# EAGLE design schematic_V3 (EAGLE 7.5.0)
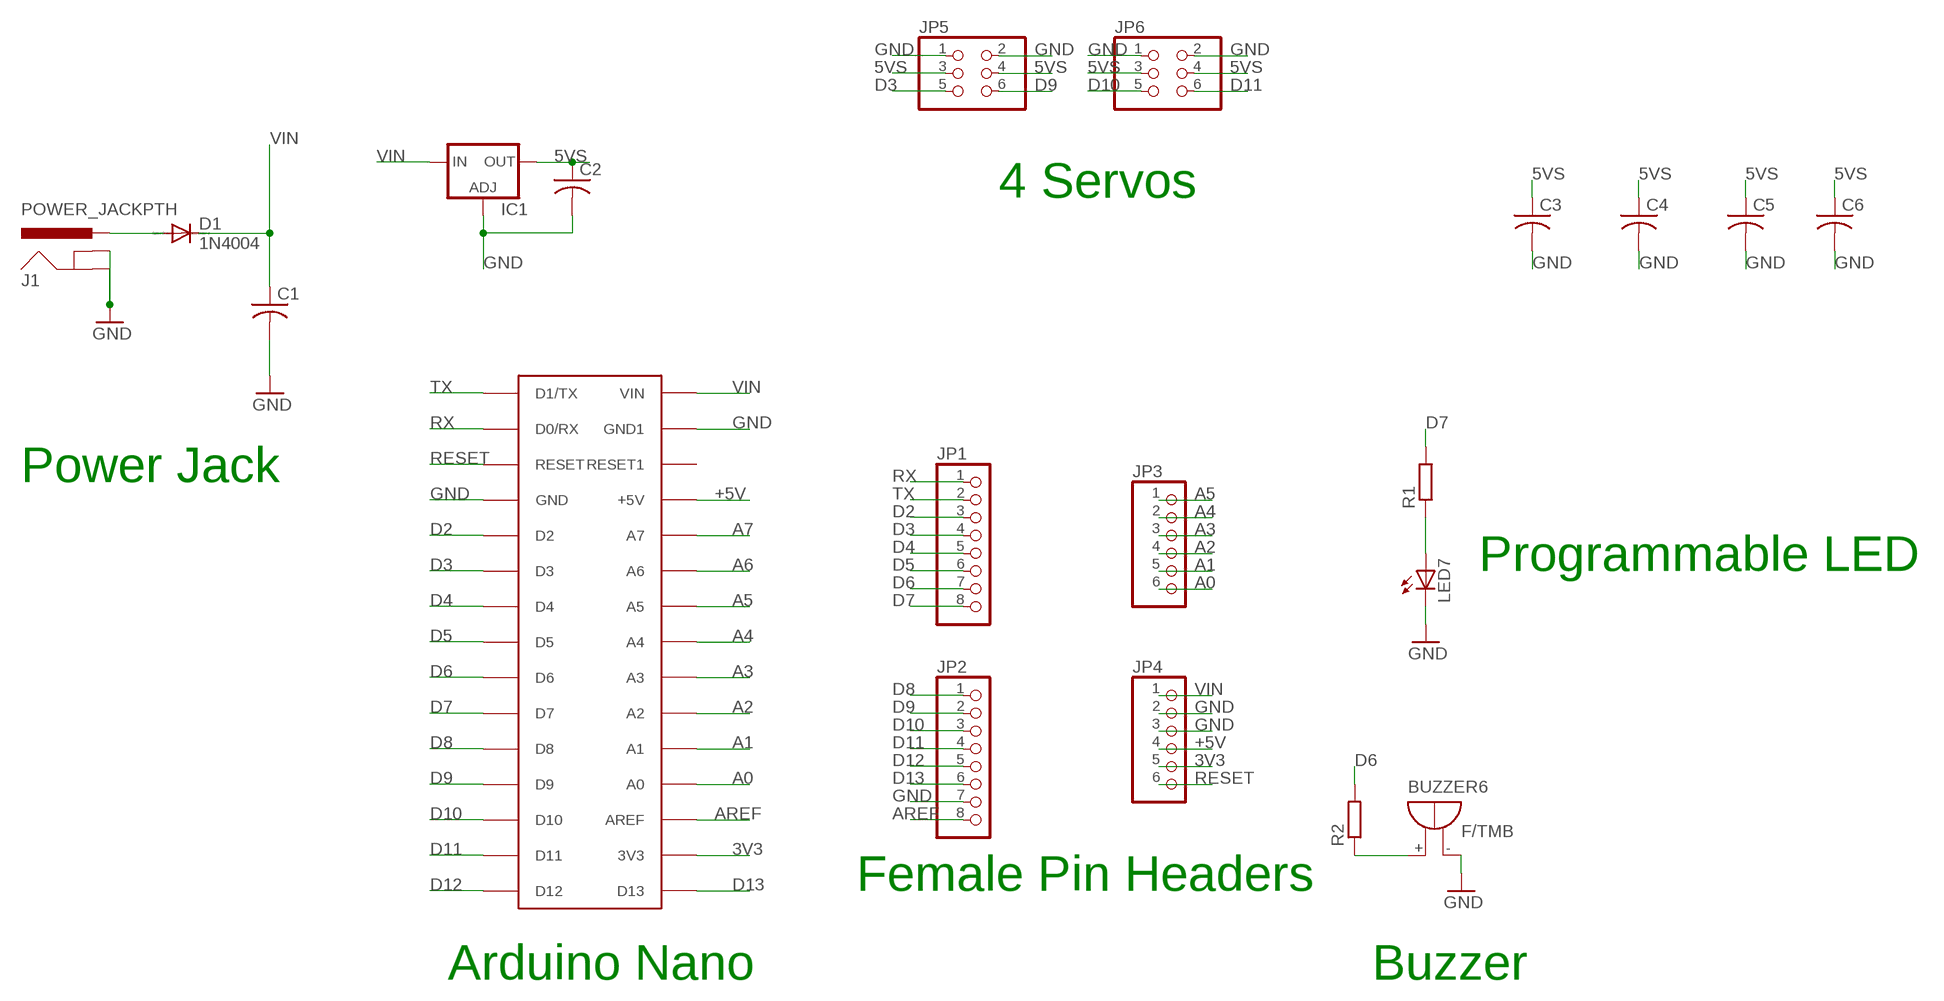
[diagram p0: schematic, sheet 1]

## Parts
BUZZER6  F/TMB  [F/TMB]
C1  C-USC1206  [C1206]
C2  C-USC1206  [C1206]
C3  C-USC1206  [C1206]
C4  C-USC1206  [C1206]
C5  C-USC1206  [C1206]
C6  C-USC1206  [C1206]
D1  1N4004  [DO41-10]
IC1  VR1  LD117AS33TR  [SOT223]
J1  POWER_JACKPTH  [POWER_JACK_PTH]
JP1  PINHD-1X8  [1X08]
JP2  PINHD-1X8  [1X08]
JP3  PINHD-1X6  [1X06]
JP4  PINHD-1X6  [1X06]
JP5  PINHD-2X3  [2X03]
JP6  PINHD-2X3  [2X03]
LED7  LED5MM  [LED5MM]
R1  R-EU_0207/10  [0207/10]
R2  R-EU_0207/10  [0207/10]
U$1  ARDUINONANO  [PDIP-32]

## Nets
3V3: JP4.5 U$1.3V3
5VS: C2.1 C3.1 C4.1 C5.1 C6.1 IC1.4(OUT) JP5.3 JP5.4 JP6.3 JP6.4
+5V: JP4.4 U$1.+5V
A0: JP3.6 U$1.A7(A0)
A1: JP3.5 U$1.A6(A1)
A2: JP3.4 U$1.A5(A2)
A3: JP3.3 U$1.A4(A3)
A4: JP3.2 U$1.A3(A4)
A5: JP3.1 U$1.A2(A5)
A6: U$1.A1(A6)
A7: U$1.A0(A7)
AREF: JP2.8 U$1.AREF
D2: JP1.3 U$1.D2
D3: JP1.4 JP5.5 U$1.D3
D4: JP1.5 U$1.D4
D5: JP1.6 U$1.D5
D6: JP1.7 R2.2 U$1.D6
D7: JP1.8 R1.2 U$1.D7
D8: JP2.1 U$1.D8
D9: JP2.2 JP5.6 U$1.D9
D10: JP2.3 JP6.5 U$1.D10
D11: JP2.4 JP6.6 U$1.D11
D12: JP2.5 U$1.D12
D13: JP2.6 U$1.D13
GND: BUZZER6.- C1.2 C2.2 C3.2 C4.2 C5.2 C6.2 IC1.1(ADJ) J1.GND J1.GNDBREAK JP2.7 JP4.2 JP4.3 JP5.1 JP5.2 JP6.1 JP6.2 LED7.K(C) U$1.GND U$1.GND1
N$1: LED7.A R1.1
N$2: D1.A J1.PWR
N$4: BUZZER6.+ R2.1
RESET: JP4.6 U$1.RESET
RX: JP1.1 U$1.D0/RX
TX: JP1.2 U$1.D1/TX
VIN: C1.1 D1.C IC1.3(IN) JP4.1 U$1.VIN
Unconnected: U$1.RESET1

## Notes on the sheet
- 4 Servos
- Power Jack
- Programmable LED
- Female Pin Headers
- Arduino Nano | Buzzer

## Library data of the parts
BUZZER6 = buzzer:F/TMB: BUZZER Source: Buerklin; OC_FARNELL: unknown; OC_NEWARK: unknown
C1-C6 = adafruit:C-US: CAPACITOR, American symbol
D1 = diode:1N4004: DIODE general purpose rectifier, 1 A
IC1 = v-reg:LD117A?*: Low drop fixed and adjustable positive voltage regulators 1 A Source: http://www.st.com/stonline/products/literature/ds/7194/ld1117axx.pdf
J1 = SparkFun:POWER_JACK: Power Jack This is the standard 5.5mm barrel jack for power. The PTH is the most common, proven, reliable, footprint. All others are experimental. The Slot footprint only works if the mill layer is transmitted to the PCB fab house so be warned. Spark Fun Electronics SKU : PRT-00119. Mating wall wart : TOL-00298 (and others)
JP1 JP2 = pinhead:PINHD-1X8: PIN HEADER
JP3 JP4 = pinhead:PINHD-1X6: PIN HEADER
JP5 JP6 = pinhead:PINHD-2X3: PIN HEADER
LED7 = led:LED: LED OSRAM: - CHIPLED LG R971, LG N971, LY N971, LG Q971, LY Q971, LO R971, LY R971 LH N974, LH R974 LS Q976, LO Q976, LY Q976 LO Q996 - Hyper CHIPLED LW Q18S LB Q993, LB Q99A, LB R99A - SideLED LS A670, LO A670, LY A670, LG A670, LP A670 LB A673, LV A673, LT A673, LW A673 LH A674 LY A675 LS A676, LA A676, LO A676, LY A676, LW A676 LS A679, LY A679, LG A679 - Hyper Micro SIDELED® LS Y876, LA Y876, LO Y876, LY Y876 LT Y87S - SmartLED LW L88C, LW L88S LB L89C, LB L89S, LG L890 LS L89K, LO L89K, LY L89K LS L896, LA L896, LO L896, LY L896 - TOPLED LS T670, LO T670, LY T670, LG T670, LP T670 LSG T670, LSP T670, LSY T670, LOP T670, LYG T670 LG T671, LOG T671, LSG T671 LB T673, LV T673, LT T673, LW T673 LH T674 LS T676, LA T676, LO T676, LY T676, LB T676, LH T676, LSB T676, LW T676 LB T67C, LV T67C, LT T67C, LS T67K, LO T67K, LY T67K, LW E67C LS E67B, LA E67B, LO E67B, LY E67B, LB E67C, LV E67C, LT E67C LW T67C LS T679, LY T679, LG T679 LS T770, LO T770, LY T770, LG T770, LP T770 LB T773, LV T773, LT T773, LW T773 LH T774 LS E675, LA E675, LY E675, LS T675 LS T776, LA T776, LO T776, LY T776, LB T776 LHGB T686 LT T68C, LB T68C - Hyper Mini TOPLED® LB M676 - Mini TOPLED Santana® LG M470 LS M47K, LO M47K, LY M47K Source: http://www.osram.convergy.de LUXEON: - LUMILED® LXK2-PW12-R00, LXK2-PW12-S00, LXK2-PW14-U00, LXK2-PW14-V00 LXK2-PM12-R00, LXK2-PM12-S00, LXK2-PM14-U00 LXK2-PE12-Q00, LXK2-PE12-R00, LXK2-PE12-S00, LXK2-PE14-T00, LXK2-PE14-U00 LXK2-PB12-K00, LXK2-PB12-L00, LXK2-PB12-M00, LXK2-PB14-N00, LXK2-PB14-P00, LXK2-PB14-Q00 LXK2-PR12-L00, LXK2-PR12-M00, LXK2-PR14-Q00, LXK2-PR14-R00 LXK2-PD12-Q00, LXK2-PD12-R00, LXK2-PD12-S00 LXK2-PH12-R00, LXK2-PH12-S00 LXK2-PL12-P00, LXK2-PL12-Q00, LXK2-PL12-R00 Source: www.luxeon.com KINGBRIGHT: KA-3528ASYC Source: www.kingbright.com
R1 R2 = rcl:R-EU_: RESISTOR, European symbol
U$1 = rocketfarm:ARDUINONANO

## Board
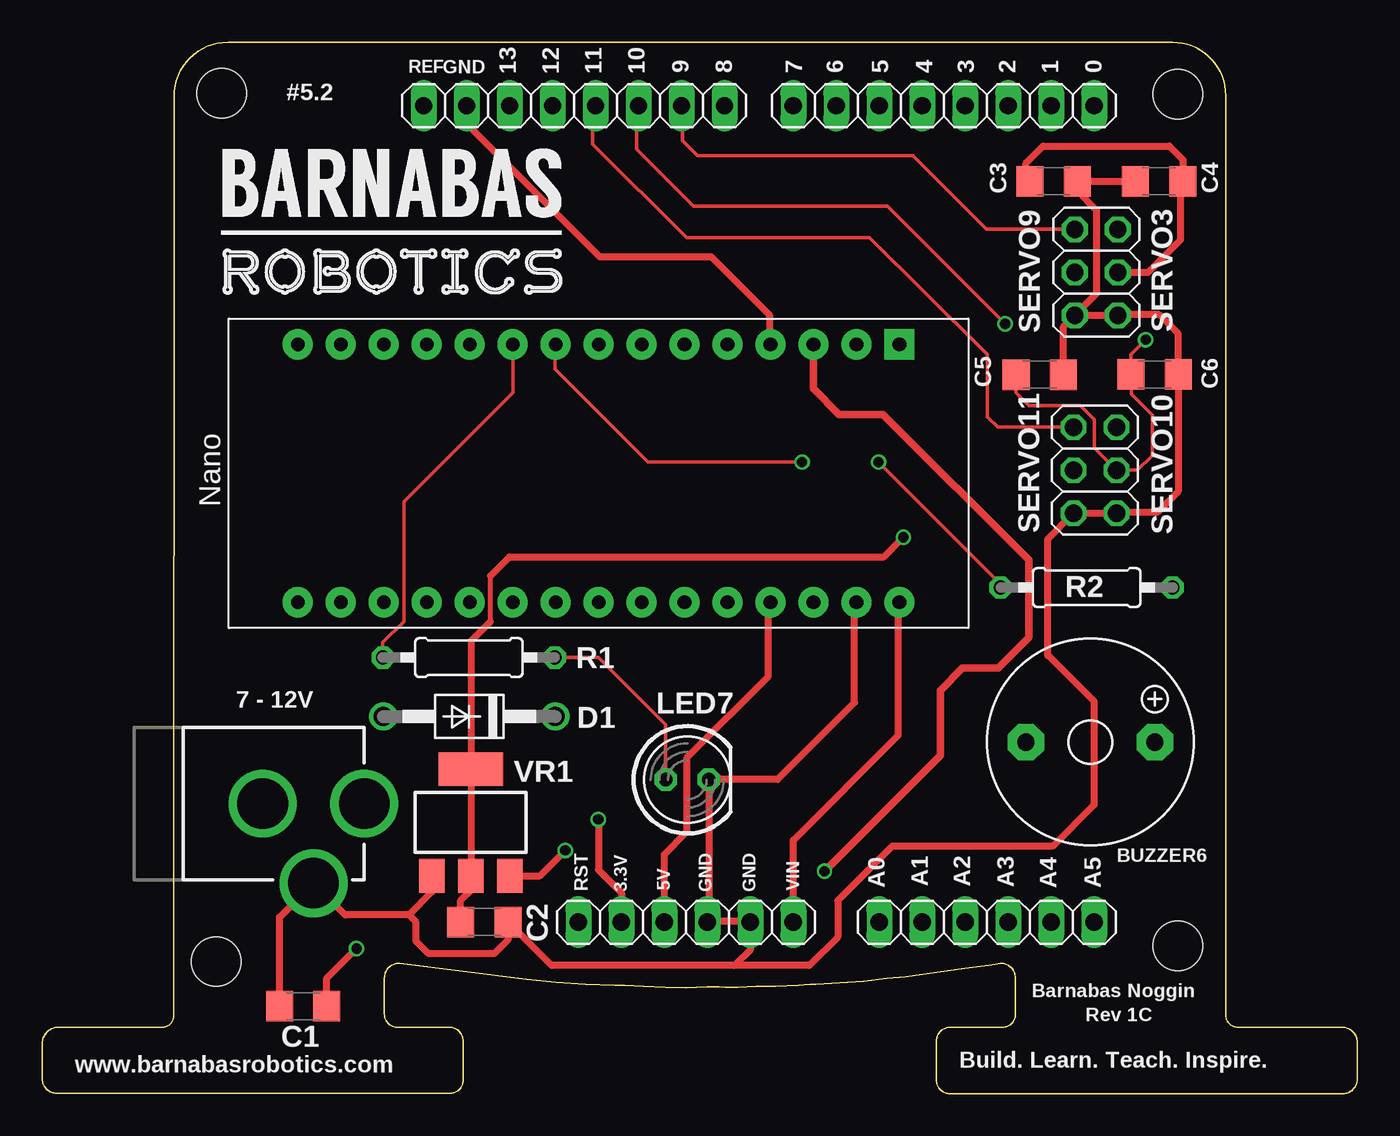
[diagram p1: board, top side]
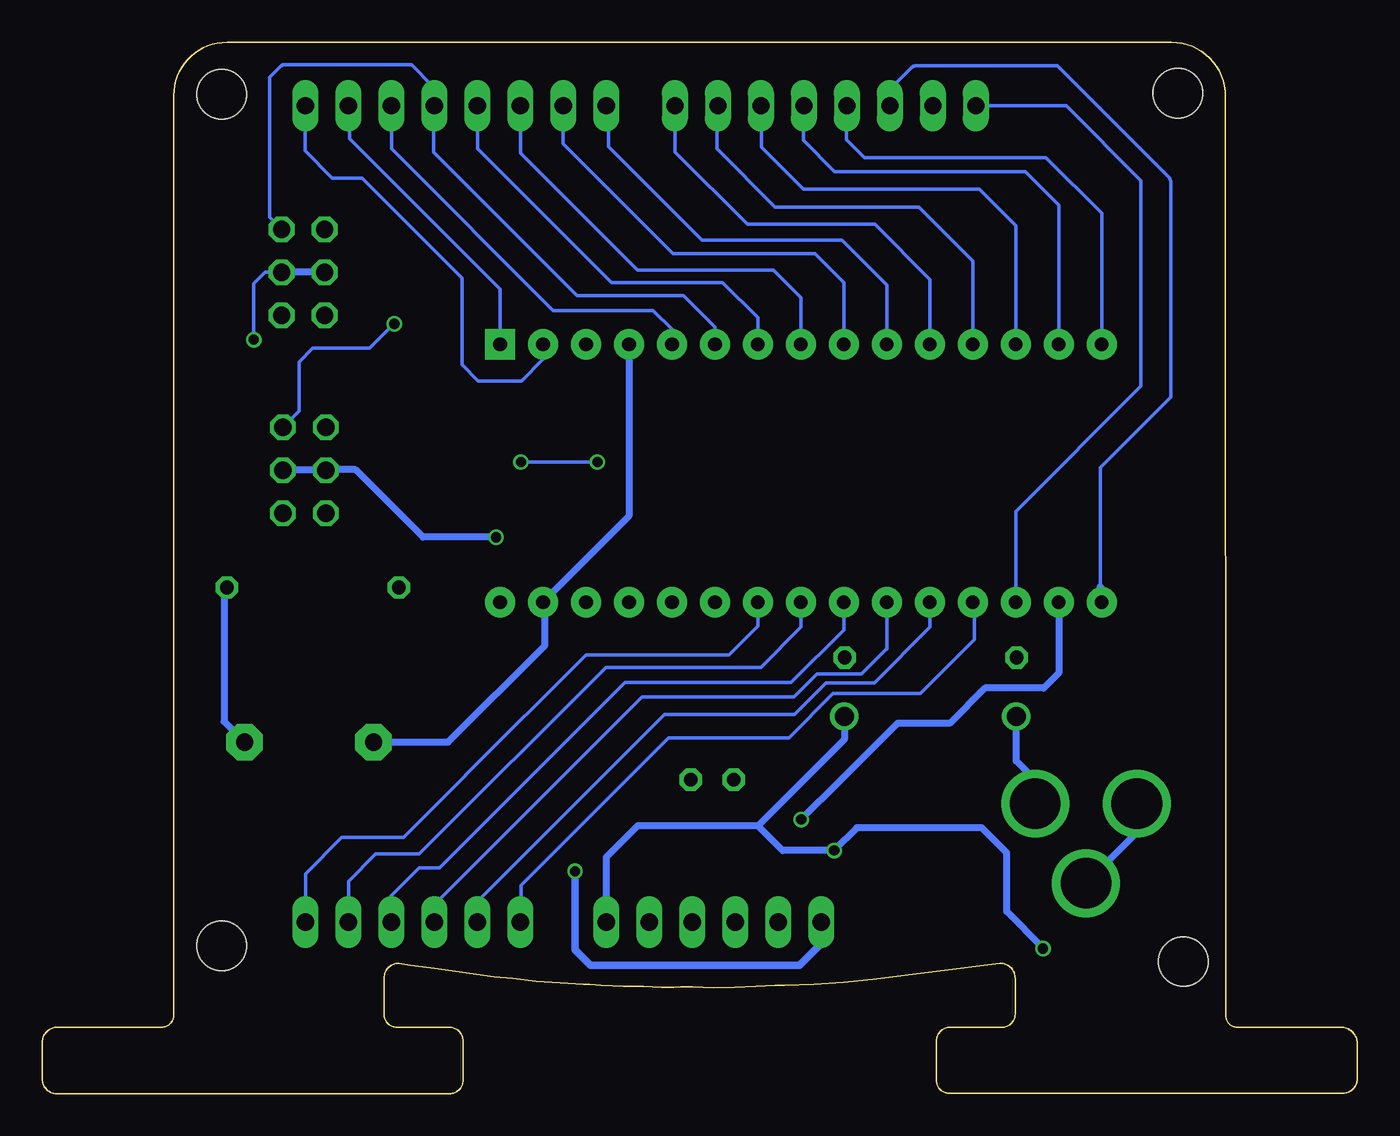
[diagram p2: board, bottom side, seen from below]

Size 77.7 x 62.13 mm. Coordinates in mm from the lower left corner, seen from the top.
Outline: 21.1,7.71 arc90 20.21,6.82 20.21,4.7 arc90 20.99,3.92 24.07,3.92 arc-90 24.86,3.13 24.86,0.76 arc-90 24.13,0.03 0.83,0.03 arc-90 0,0.86 0,2.97 arc-90 0.96,3.93 7.11,3.93 arc90 7.76,4.58 7.78,58.94 arc-90 10.97,62.13 66.79,62.13 arc-90 69.93,58.99 69.93,4.64 arc90 70.64,3.93 76.8,3.93 arc-90 77.7,3.03 77.7,0.84 arc-90 76.86,0 53.62,0 arc-90 52.84,0.78 52.84,3.08
Outline: 56.63,7.71 arc-90 57.5,6.84 57.5,4.66 arc-90 56.77,3.93 53.66,3.93 arc90 52.84,3.11 52.84,3.1
Outline: 21.11,7.71 28.63,6.75 arc7 33.83,6.41 arc-4 35.54,6.34 arc8 39.28,6.3 arc-7 40.36,6.29 arc9 41.1,6.29 arc-5 42.71,6.34 arc5 44.67,6.41 arc-3 45.71,6.47 arc6 49.92,6.81 arc-4 51,6.91
Outline: 51.01,6.91 54.53,7.39 arc2 56.64,7.71
Copper layers (1*16): Top 0.035mm / dielectric 1.5mm / Bottom 0.035mm
Design rules "EagleRules": minimum track width 7mil, minimum drill 12mil, track to track 7mil, track to pad 7mil, pad to pad 7mil, via to via 7mil, smd to smd 0mil, copper to edge 20mil, drill to drill 10mil, minimum pad ring 10mil, minimum via ring 6mil, stop-mask expansion 2mil, vias tented up to drill 25mil, thermal gap 10mil
Holes 2.9 mm at 10.6,59.12 67.1,59.06 67.1,8.73 10.28,7.81

### Footprints (pad centres in the part's own frame; a part is rotated, then mirrored left to right if it is on the bottom)
F/TMB = drill 1.016 pad 2.159 octagon: + 3.81,0; - -3.81,0
C1206 = smd 1.6 x 1.8: 1 -1.4,0; 2 1.4,0
DO41-10 = drill 1.118: A 5.08,0; C -5.08,0
SOT223 = smd 1.5 x 2: 1 -2.3,-3.15; 2 0,-3.15; 3 2.3,-3.15 | smd 3.8 x 2: 4 0,3.15
POWER_JACK_PTH = drill 2.997: GND 0,7.7; GNDBREAK 4.7,10.7; PWR 0,13.7
1X08 = drill 1.016 long: 1 -8.89,0; 2 -6.35,0; 3 -3.81,0; 4 -1.27,0; 5 1.27,0; 6 3.81,0; 7 6.35,0; 8 8.89,0
1X06 = drill 1.016 long: 1 -6.35,0; 2 -3.81,0; 3 -1.27,0; 4 1.27,0; 5 3.81,0; 6 6.35,0
2X03 = drill 1.016 octagon: 1 -2.54,-1.27; 2 -2.54,1.27; 3 0,-1.27; 4 0,1.27; 5 2.54,-1.27; 6 2.54,1.27
LED5MM = drill 0.813 octagon: A -1.27,0; K 1.27,0
0207/10 = drill 0.813 octagon: 1 -5.08,0; 2 5.08,0
PDIP-32 = drill 0.8 pad 1.778: 3V3 15.24,-35.56; +5V 15.24,-10.16; A0 15.24,-12.7; A1 15.24,-15.24; A2 15.24,-17.78; A3 15.24,-20.32; A4 15.24,-22.86; A5 15.24,-25.4; A6 15.24,-27.94; A7 15.24,-30.48; AREF 15.24,-33.02; D0/RX 0,-5.08; D2 0,-12.7; D3 0,-15.24; D4 0,-17.78; D5 0,-20.32; D6 0,-22.86; D7 0,-25.4; D8 0,-27.94; D9 0,-30.48; D10 0,-33.02; D11 0,-35.56; D12 0,-38.1; D13 15.24,-38.1; GND 0,-10.16; GND1 15.24,-5.08; RESET 0,-7.62; RESET1 15.24,-7.62; VIN 15.24,-2.54 | drill 0.8 pad 1.778 square: D1/TX 0,-2.54

### Placement (x,y rotation side)
BUZZER6  61.93,20.77 0 top
C1  15.41,5.16 180 top
C2  26.12,10.15 0 top
C3  59.75,53.92 0 top
C4  66,53.92 180 top
C5  58.95,42.49 0 top
C6  65.72,42.49 0 top
D1  25.23,22.29 180 top
IC1  25.32,16.02 0 top
J1  5.33,17.14 270 top
JP1  53.27,58.38 180 top
JP2  31.43,58.38 180 top
JP3  55.81,10.13 180 top
JP4  38.03,10.13 180 top
JP5  62.29,48.54 90 top
JP6  62.21,36.84 90 top
LED7  38.11,18.55 0 top
R1  25.2,25.77 180 top
R2  61.72,29.91 180 top
U$1  53.19,44.28 270 top

### Tracks (layer width: path | path; a pad name or v marks a point on that pad's centre or on a via)
3V3  (via drill 0.6)
  Top 0.406: v32.86,16.2 32.86,13.23 34.21,11.88 JP4.5
  Bottom 0.406: U$1.3V3 17.63,24.86 18.52,23.97 22,23.97 24.08,21.89 27.16,21.89 30.59,18.46 v32.86,16.2
5VS  (via drill 0.6)
  Top 0.203: C3.1 58.52,53.92 58.62,53.82 | v65.2,44.55 64.32,43.67 C6.1 64.36,42.45 64.36,41.33 65.59,40.1 65.59,37.72 64.71,36.84 JP6.3 62.17,38.15 62.17,39.84 61.35,40.66 58.31,40.66 57.55,41.42 C5.1
  Top 0.305: 26.48,27.9 26.48,30.6
  Top 0.406: 58.62,53.82 58.34,53.82 58.13,54.02 58.13,54.98 59.14,55.99 66.61,55.99 67.41,55.19 C4.1 67.28,53.8 67.28,50.47 65.35,48.54 JP5.3 | C2.1 24.72,11.41 25.36,12.04 25.36,19.13 | 25.36,19.13 IC1.4 | 25.36,19.13 25.36,26.77 26.48,27.9 | 26.48,30.6 27.6,31.71 49.72,31.71 v50.89,32.88
  Bottom 0.203: v65.2,44.55 65.2,47.87 64.54,48.54 JP5.3
  Bottom 0.406: v50.89,32.88 55.21,32.88 59.19,36.87 60.91,36.87 JP6.4 JP6.3 | JP5.4 JP5.3
+5V
  Top 0.406: JP4.4 36.76,14.14 38.1,15.48 38.1,19.86 42.91,24.66 42.91,28.92 U$1.+5V
A0
  Bottom 0.203: U$1.A7 22.71,28.79 | JP3.6 49.4,10.19 49.4,12.32 40.73,20.99 40.7,21.02 40.69,21.03 33.59,21.03 30.96,23.66 25.82,23.66 22.63,26.85 22.63,28.47 22.66,28.51 22.66,28.84 22.71,28.79 | 22.71,28.65 22.71,28.79
A1
  Bottom 0.203: U$1.A6 25.25,27.56 28.54,24.27 31.38,24.27 33.25,22.41 40.91,22.41 40.92,22.42 51.9,11.44 51.9,10.23 JP3.5
A2
  Bottom 0.203: U$1.A5 27.79,26.28 27.83,26.28 29.3,24.81 31.94,24.81 33.3,23.45 42.27,23.45 54.26,11.45 54.26,10.41 JP3.4
A3
  Bottom 0.203: U$1.A4 30.33,27.4 33.45,24.29 43.28,24.29 54.22,13.35 55.42,13.35 57.08,11.69 JP3.3
A4
  Bottom 0.203: U$1.A3 32.87,27.57 35.25,25.2 44.39,25.2 55.42,14.16 57.99,14.16 59.6,12.55 59.6,10.16 JP3.2
A5
  Bottom 0.203: U$1.A2 35.41,27.62 37.12,25.92 45.58,25.92 52.68,18.82 52.68,18.81 56.36,15.13 60.01,15.13 62.15,12.99 JP3.1
AREF
  Bottom 0.203: U$1.AREF 20.17,34.4 12.77,41.8 12.77,53.97 17.19,58.38 JP2.8
  Bottom 0.406: JP2.8
D2
  Bottom 0.203: U$1.D2 40.49,45.18 41.6,46.29 47.51,46.29 57.07,55.85 57.07,58.37
  Bottom 0.406: 57.07,58.37 JP1.3
D3
  Bottom 0.203: U$1.D3 37.95,45.29 39.82,47.16 46.11,47.16 54.58,55.63 54.58,58.34 | 54.65,59.57 55.88,60.79 63.46,60.79 arc-45 63.59,60.74 64.26,60.07 64.26,52.98 64.27,52.97 64.27,51.78 JP5.5
  Bottom 0.406: 54.58,58.34 JP1.4 54.65,58.5 54.65,59.57
D4
  Bottom 0.203: U$1.D4 35.41,45.84 37.5,47.93 44.07,47.93 51.98,55.84 51.98,58.37
  Bottom 0.406: 51.98,58.37 JP1.5
D5
  Bottom 0.203: U$1.D5 32.87,47.05 34.5,48.67 42.53,48.67 49.45,55.59 JP1.6
  Bottom 0.406: JP1.6
D6  (via drill 0.6)
  Top 0.203: R2.2 56.83,29.91 v49.41,37.32 | v44.9,37.32 35.8,37.32 30.29,42.83 30.29,44.24 U$1.D6
  Bottom 0.203: U$1.D6 30.33,47.94 32.04,49.65 40.44,49.65 46.94,56.15 46.94,58.36 | v49.41,37.32 v44.9,37.32
  Bottom 0.406: 46.94,58.36 JP1.7
D7
  Top 0.203: R1.2 20.12,26.66 21.37,27.91 21.37,34.98 27.81,41.42 27.81,44.26 U$1.D7
  Bottom 0.203: U$1.D7 27.79,47.77 30.46,50.44 38.72,50.44 44.25,55.96 44.25,58.26
  Bottom 0.406: 44.25,58.26 JP1.8
D8
  Bottom 0.203: U$1.D8 25.25,48.11 28.51,51.37 36.03,51.37 40.3,55.64 40.3,58.37
  Bottom 0.406: 40.3,58.37 JP2.1
D9
  Top 0.203: 37.84,58.32 37.84,56.31 38.71,55.44 51.45,55.44 55.79,51.1 61,51.1 JP5.6
  Top 0.406: 37.84,58.32 JP2.2
  Bottom 0.203: U$1.D9 22.71,49.2 25.91,52.39 34.41,52.39 37.84,55.83 37.84,58.32
  Bottom 0.406: 37.84,58.32 JP2.2
D10  (via drill 0.6)
  Top 0.203: 35.1,57.79 35.1,55.83 38.49,52.43 49.95,52.43 v56.89,45.49
  Top 0.406: 35.1,57.79 35.2,57.88 35.2,58.34 JP2.3
  Bottom 0.203: U$1.D10 20.17,51.3 22.33,53.46 32.73,53.46 35.2,55.92 35.2,58.34 | v56.89,45.49 56.91,45.49 58.35,44.05 61.71,44.05 62.52,43.23 62.52,40.34 JP6.5
  Bottom 0.406: 35.2,58.34 JP2.3
D11
  Top 0.203: JP6.6 56.46,39.38 55.85,39.98 55.85,43.68 55.59,43.95 48.89,50.58 38.06,50.58 32.52,56.12 32.52,58.2
  Top 0.406: 32.52,58.2 JP2.4
  Bottom 0.203: U$1.D11 17.63,52.52 19.59,54.48 30.88,54.48 32.73,56.34 32.73,58.35
  Bottom 0.406: 32.73,58.35 JP2.4
D12
  Bottom 0.203: U$1.D12 15.09,52.02 18.39,55.32 29.11,55.32 30.18,56.39 30.18,58.36
  Bottom 0.406: 30.18,58.36 JP2.5
D13
  Bottom 0.203: 15.18,29.94 15.18,36.99 11,41.16 11,53.77 arc-45 11.19,54.22 17.71,60.74 26.09,60.74 arc-45 26.32,60.64 | 26.25,60.71 26.32,60.64 | 26.32,60.64 27.64,59.32
  Bottom 0.406: U$1.D13 15.09,29.85 15.18,29.94 | 27.64,59.32 27.64,58.41 JP2.6
GND
  Top 0.203: 42.98,44.33 U$1.GND | C3.2 61.15,53.75 60.86,53.46 | 63.52,34.34 JP6.1 | 63.59,46.03 JP5.1
  Top 0.406: U$1.GND1 48,28.93 48,23.11 43.45,18.56 39.4,18.56 LED7.K 39.38,10.22 | JP2.7 25.08,57.32 32.94,49.45 39.53,49.45 42.98,46 42.98,44.33 | C3.2 C4.2 | 60.86,53.46 61.06,53.46 62.3,52.22 62.3,47.28 JP5.2 | C1.2 14.01,10.43 J1.GNDBREAK 17.9,10.56 21.67,10.56 | IC1.1 23.02,11.92 21.67,10.56 | 40.9,7.57 45.33,7.57 47,9.24 47,11.41 50.21,14.61 59.7,14.61 62.14,17.05 62.14,23.2 59.41,25.93 59.41,25.89 59.41,32.77 JP6.2 JP6.1 | 40.9,7.57 30.1,7.57 C2.2 27.52,9.08 26.7,8.26 22.84,8.26 22.09,9.01 22.09,10.15 21.67,10.56 | 40.9,7.57 41.84,8.51 JP4.2 41.75,10.22 39.38,10.22 | 63.52,34.34 65.88,34.34 67.12,35.58 C6.2 67.12,44.91 66,46.03 63.59,46.03 | JP5.2 JP5.1 | C5.2 60.35,45.32 JP5.2 | 39.38,10.22 JP4.3
  Bottom 0.406: U$1.GND 43.03,34.12 U$1.GND1 48,28.93 48,26.49 53.71,20.77 BUZZER6.- | J1.GND 13.03,15.44 J1.GNDBREAK
N$1
  Top 0.203: R1.1 32.86,25.77 36.82,21.81 36.82,18.57 LED7.A
N$2
  Bottom 0.406: J1.PWR 19.03,18.53 20.14,19.65 D1.A
N$4
  Bottom 0.406: R2.1 66.97,29.74 66.97,21.99 BUZZER6.+
RESET  (via drill 0.6)
  Top 0.45: U$1.RESET 45.57,41.66 47.09,40.14 49.69,40.14 58.31,31.52 58.31,26.95 56.51,25.15 54.37,25.15 53.06,23.84 53.06,19.98 v46.22,13.14
  Bottom 0.45: v46.22,13.14 46.22,8.51 45.3,7.58 32.95,7.58 31.67,8.87 31.67,10.12 JP4.6
RX
  Bottom 0.203: U$1.D0/RX 48.11,43.4 49.39,42.12 51.94,42.12 52.9,43.09 52.9,48.21 58.8,54.11 60.57,54.11 62.18,55.72 62.18,58.36
  Bottom 0.406: 62.18,58.36 JP1.1
TX
  Bottom 0.203: U$1.D1/TX 50.65,47.53 59.54,56.43 59.54,58.31
  Bottom 0.406: 59.54,58.31 JP1.2
VIN  (via drill 0.6)
  Top 0.406: JP4.1 44.38,14.98 50.59,21.19 50.59,28.98 U$1.VIN | IC1.3 29.41,12.87 v30.91,14.37 | C1.1 16.81,6.82 v18.56,8.57
  Bottom 0.406: D1.C 30.31,20.93 35.41,15.83 | 35.41,15.83 42.52,15.83 44.38,13.97 JP4.1 | 35.41,15.83 33.95,14.37 v30.91,14.37 29.57,15.71 22.19,15.71 20.71,14.23 20.71,10.76 18.56,8.61 v18.56,8.57

### Text on the board
tPlace: 13 | 12 | 11 | 10 | GND | REF | 9 | 8 | 7 | 6 | 5 | 4 | 3 | 2 | 1 | 0 | #5.2 | SERVO9 | SERVO3 | SERVO11 | SERVO10 | 7 - 12V | VR1 | RST | 3.3V | 5V | GND | GND | VIN | A0 | A1 | A2 | A3 | A4 | A5 | Barnabas Noggin | Rev 1C | Build. Learn. Teach. Inspire. | www.barnabasrobotics.com